# Altium schematic sheet 05 MSM8916_CONTROL.SchDoc
size 868 x 576 mm
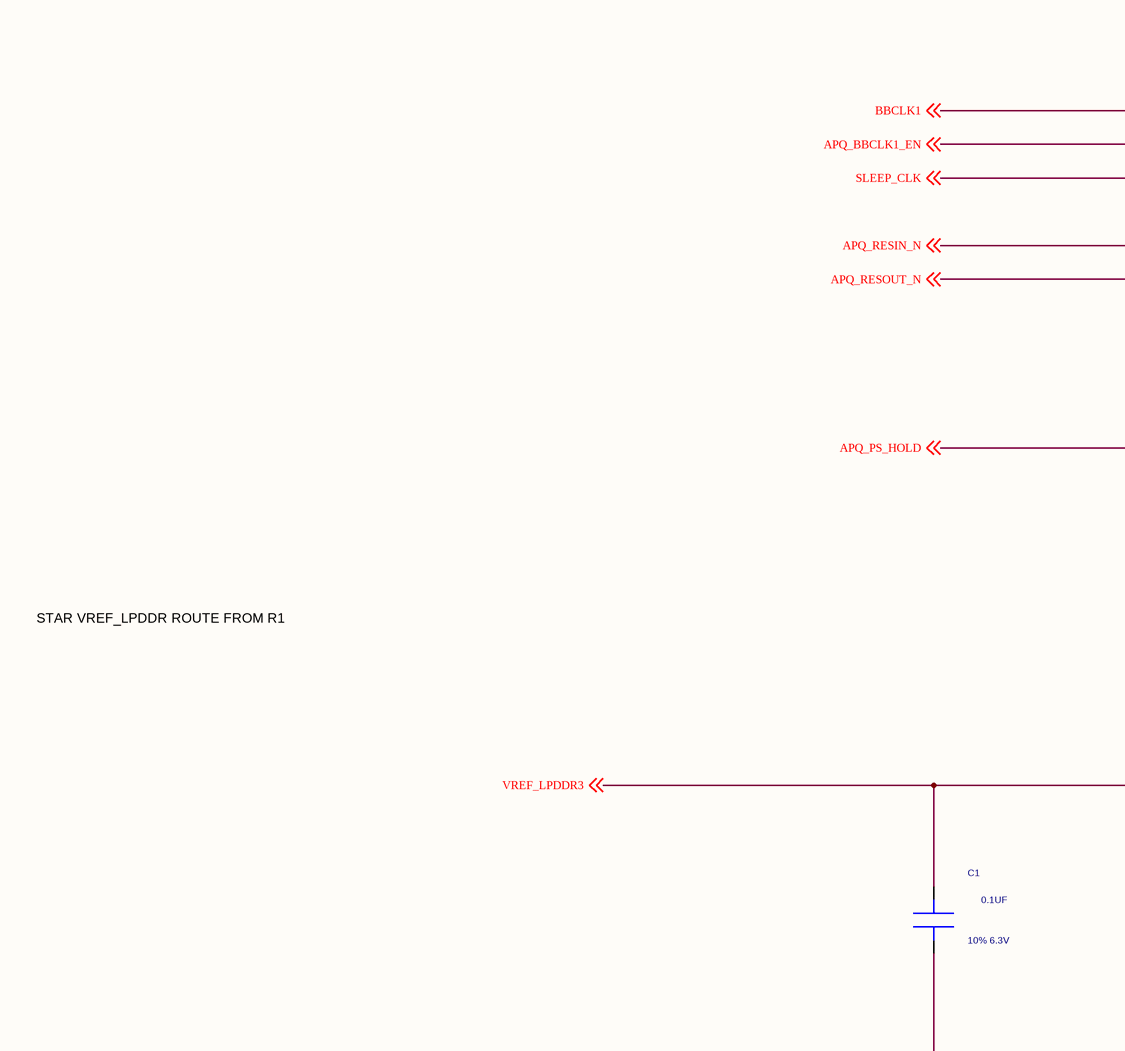
[diagram p0: 05 MSM8916_CONTROL.SchDoc, top left]
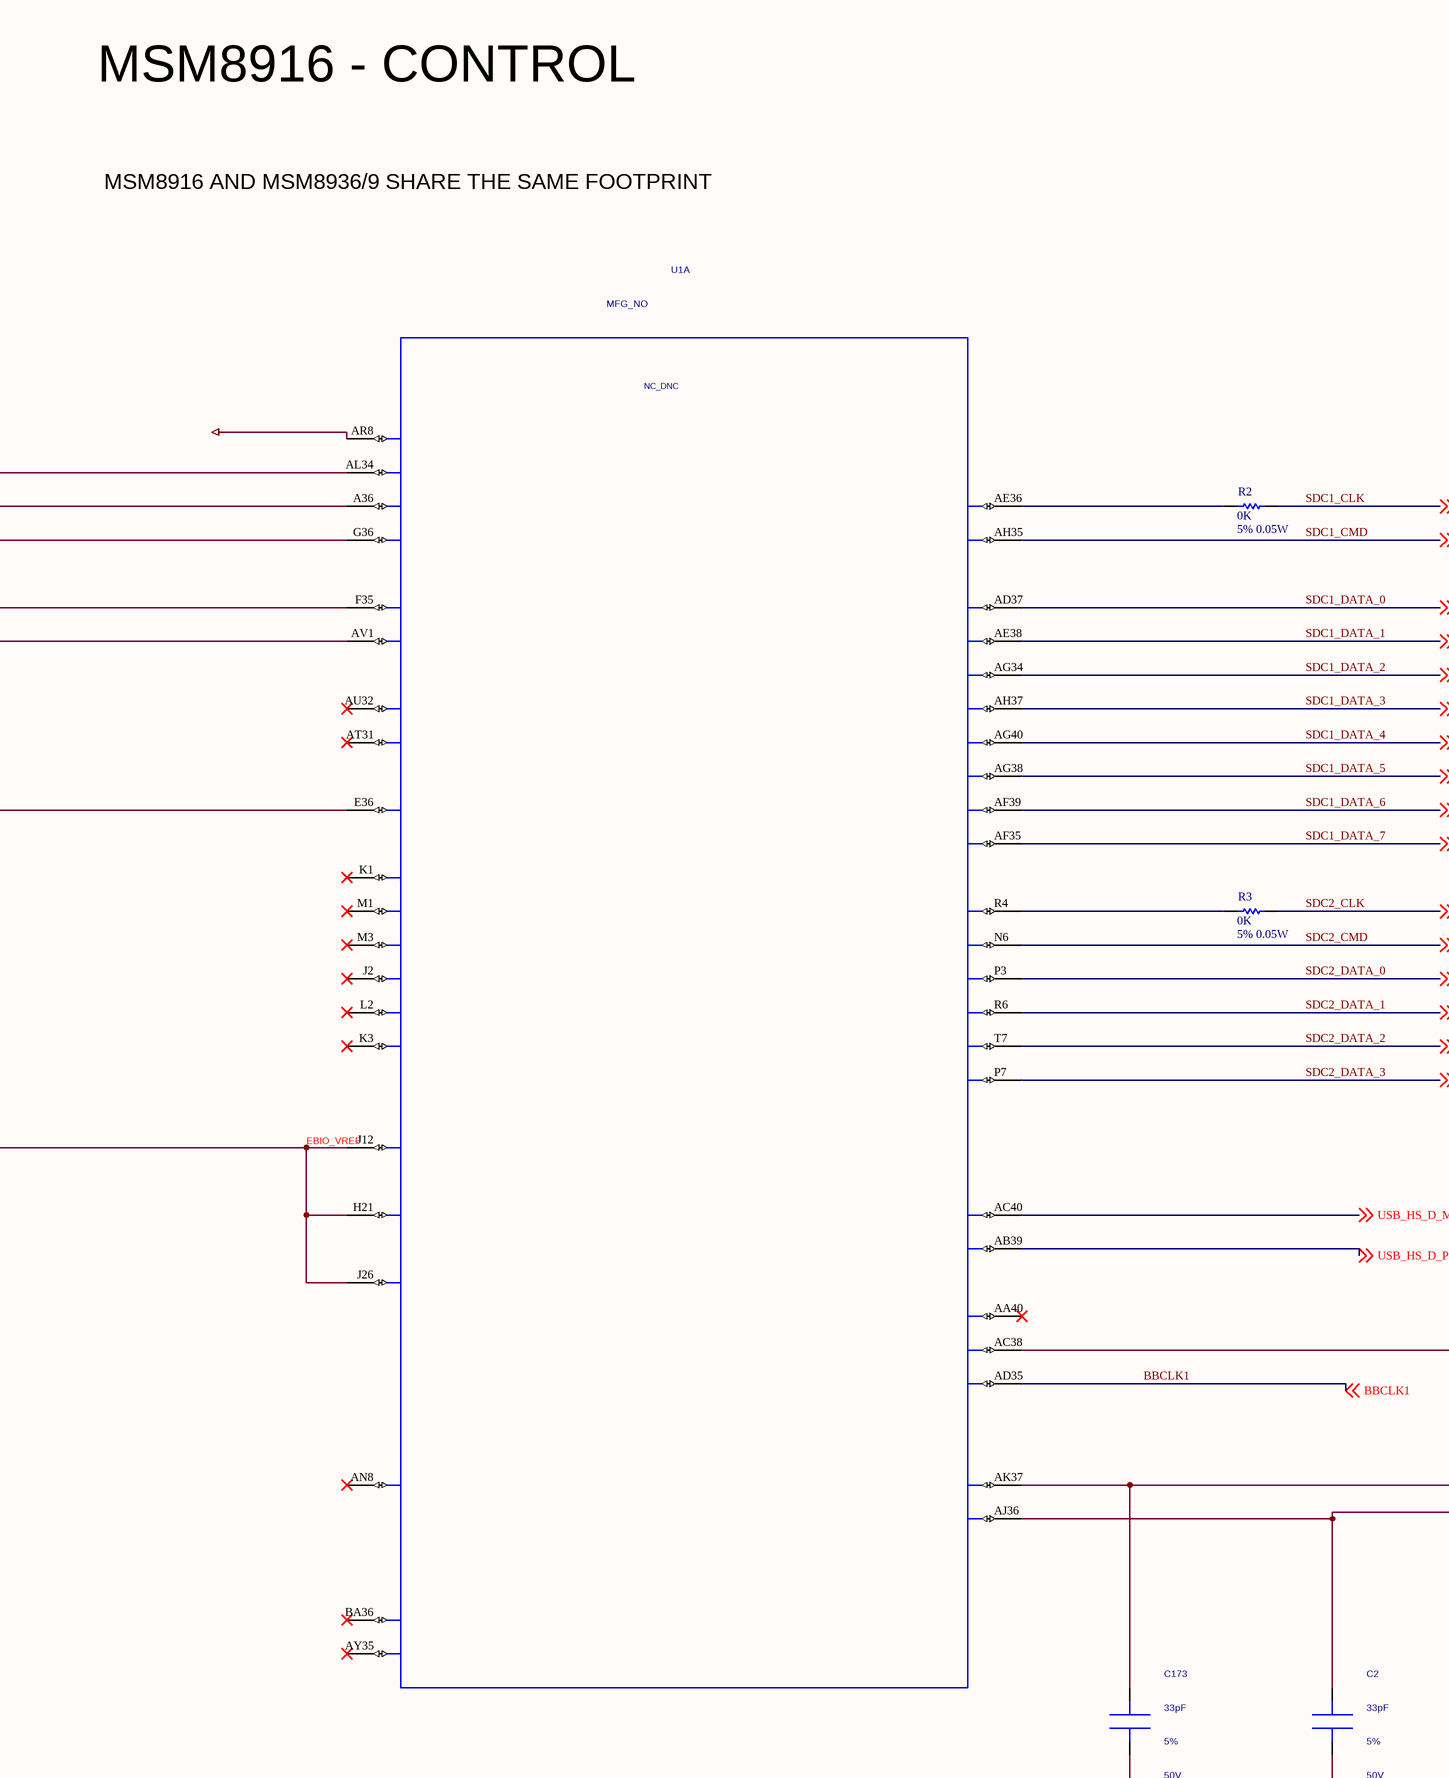
[diagram p1: 05 MSM8916_CONTROL.SchDoc, top middle]
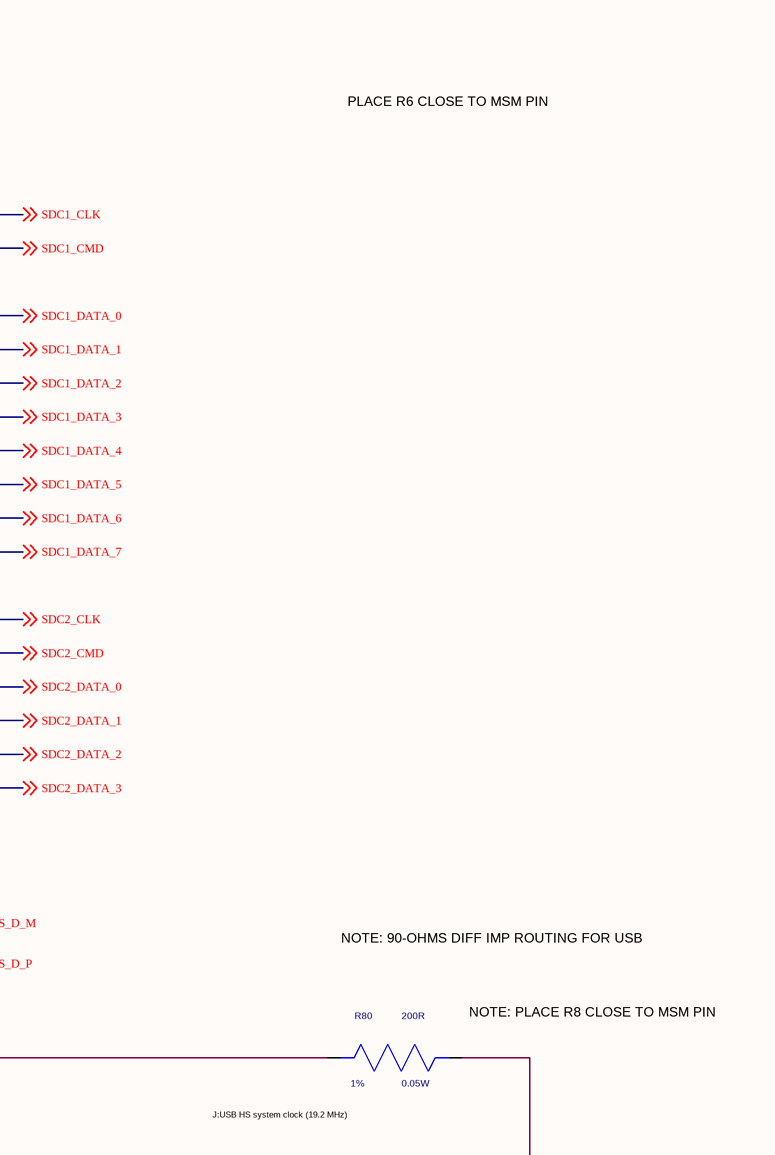
[diagram p2: 05 MSM8916_CONTROL.SchDoc, top right]
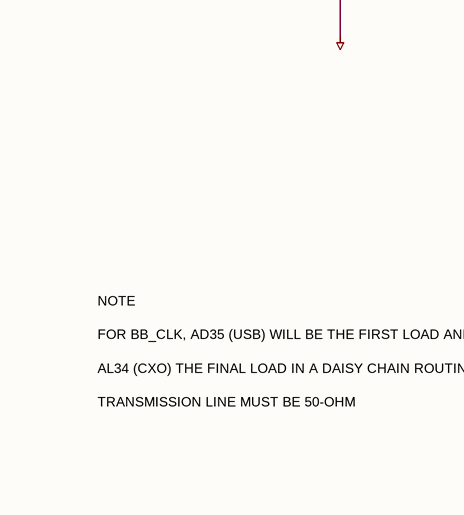
[diagram p3: 05 MSM8916_CONTROL.SchDoc, bottom left]
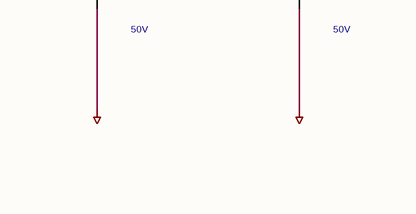
[diagram p4: 05 MSM8916_CONTROL.SchDoc, bottom middle]
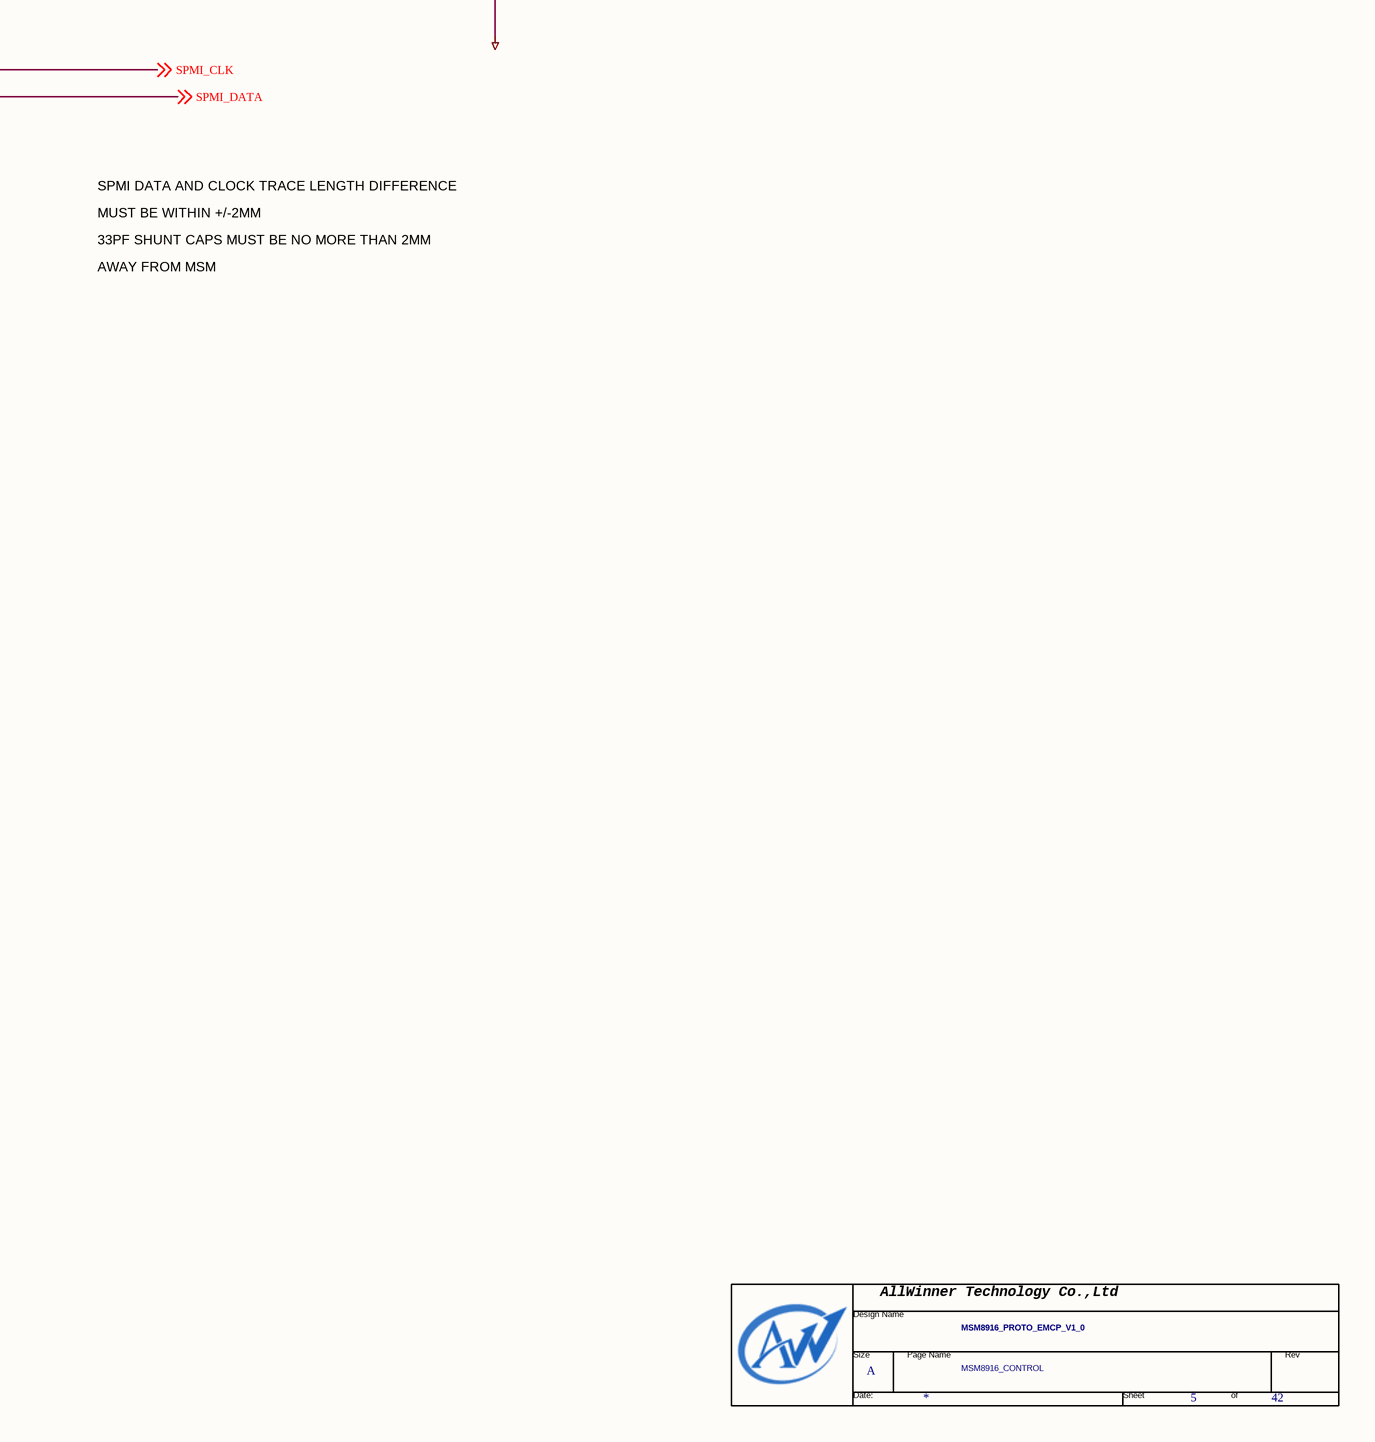
[diagram p5: 05 MSM8916_CONTROL.SchDoc, bottom right]

## Parts
*  Page Count: 42  Page Number: 5  Page Size: A  Title: MSM8916_PROTO_EMCP_V1_0  Doc: MSM8916_CONTROL  (hidden comment: TitleBlock0-AW)  (graphical)
C1  0.1UF  Tolerance: 10% 6.3V  [c0402]
C2  33pF  VOLT: 50V  Tolerance: 5%  [c0402]
C173  33pF  VOLT: 50V  Tolerance: 5%  [c0402]
R2  0K  value 5% 0.05W  [r0402]
R3  0K  value 5% 0.05W  [r0402]
R80  200R  Tolerance: 1%  POWER: 0.05W  [c0402]
U1  SYMNAME: NC_DNC  PART_ID: MFG_NO  [MSM-8916-0-760NSP-TR-00-0]  (hidden comment: ASIC_MSM8936_760PIN)  (part A of 13)

## Nets
DGND: C1.2(NEG) C2.2(NEG) C173.2(NEG) R80.2(NEG) U1.AR8(WCSS_XO)
APQ_BBCLK1_EN: U1.A36(CXO_EN) ; off-sheet APQ_BBCLK1_EN
APQ_PS_HOLD: U1.E36(PS_HOLD) ; off-sheet APQ_PS_HOLD
APQ_RESIN_N: U1.F35(RESIN*) ; off-sheet APQ_RESIN_N
APQ_RESOUT_N: U1.AV1(RESOUT*) ; off-sheet APQ_RESOUT_N
BBCLK1: U1.AD35(USB2_HS_SYSCLOCK) U1.AL34(CXO) ; off-sheet BBCLK1
EBIO_VREF: C1.1(POS) U1.H21(VREF_EBI0_D0_D2) U1.J12(VREF_EBI0_CA) U1.J26(VREF_EBI0_D1_D3) ; off-sheet VREF_LPDDR3  [also labelled VREF_LPDDR3]
SDC1_CLK: R2.2 ; off-sheet SDC1_CLK
SDC1_CMD: U1.AH35(SDC1_CMD) ; off-sheet SDC1_CMD
SDC1_DATA_0: U1.AD37(SDC1_DATA_0) ; off-sheet SDC1_DATA_0
SDC1_DATA_1: U1.AE38(SDC1_DATA_1) ; off-sheet SDC1_DATA_1
SDC1_DATA_2: U1.AG34(SDC1_DATA_2) ; off-sheet SDC1_DATA_2
SDC1_DATA_3: U1.AH37(SDC1_DATA_3) ; off-sheet SDC1_DATA_3
SDC1_DATA_4: U1.AG40(SDC1_DATA_4) ; off-sheet SDC1_DATA_4
SDC1_DATA_5: U1.AG38(SDC1_DATA_5) ; off-sheet SDC1_DATA_5
SDC1_DATA_6: U1.AF39(SDC1_DATA_6) ; off-sheet SDC1_DATA_6
SDC1_DATA_7: U1.AF35(SDC1_DATA_7) ; off-sheet SDC1_DATA_7
SDC2_CLK: R3.2 ; off-sheet SDC2_CLK
SDC2_CMD: U1.N6(SDC2_CMD) ; off-sheet SDC2_CMD
SDC2_DATA_0: U1.P3(SDC2_DATA_0) ; off-sheet SDC2_DATA_0
SDC2_DATA_1: U1.R6(SDC2_DATA_1) ; off-sheet SDC2_DATA_1
SDC2_DATA_2: U1.T7(SDC2_DATA_2) ; off-sheet SDC2_DATA_2
SDC2_DATA_3: U1.P7(SDC2_DATA_3) ; off-sheet SDC2_DATA_3
SLEEP_CLK: U1.G36(SLEEP_CLK) ; off-sheet SLEEP_CLK
SPMI_CLK: C173.1(POS) U1.AK37(PMIC_SPMI_CLK) ; off-sheet SPMI_CLK
SPMI_DATA: C2.1(POS) U1.AJ36(PMIC_SPMI_DATA) ; off-sheet SPMI_DATA
USB_HS_D_M: U1.AC40(USB2_HS_DM) ; off-sheet USB_HS_D_M
USB_HS_D_P: U1.AB39(USB2_HS_DP) ; off-sheet USB_HS_D_P
NetR2_1: R2.1 U1.AE36(SDC1_CLK)
NetR3_1: R3.1 U1.R4(SDC2_CLK)
NetR80_1: R80.1(POS) U1.AC38(USB2_HS_TXRTUNE)

Not connected (* = marked no-connect by the designer): U1 AA40(USB2_HS_ID)* AN8(PLL_TEST_SE)* AT31(MODE_1)* AU32(MODE_0)* AY35(ATEST1)* BA36(ATEST0)* J2(TDO)* K1(SRST*)* K3(TRST*)* L2(TMS)* M1(TCK)* M3(TDI)*

## Notes on the sheet
- MSM8916 - CONTROL
- MSM8916 AND MSM8936/9 SHARE THE SAME FOOTPRINT
- PLACE R6 CLOSE TO MSM PIN
- STAR VREF_LPDDR ROUTE FROM R1
- NOTE: 90-OHMS DIFF IMP ROUTING FOR USB
- (near R80) NOTE: PLACE R8 CLOSE TO MSM PIN
- J:USB HS system clock (19.2 MHz)
- SPMI DATA AND CLOCK TRACE LENGTH DIFFERENCE
- MUST BE WITHIN +/-2MM
- 33PF SHUNT CAPS MUST BE NO MORE THAN 2MM
- AWAY FROM MSM
- FOR BB_CLK, AD35 (USB) WILL BE THE FIRST LOAD AND
- NOTE
- AL34 (CXO) THE FINAL LOAD IN A DAISY CHAIN ROUTING
- TRANSMISSION LINE MUST BE 50-OHM
- (in symbol TitleBlock0-AW) AllWinner Technology Co.,Ltd; Design Name; Size; Page Name; Rev; Date:; Sheet; of

## Library data of the parts
C1 = CAP: PART_NUMBER: MCN_NO; PART_ID: MFG_NO; OriginalSymbolOrigin: (-100,75); VOLT: ?V; CDS_LMAN_SYM_OUTLINE: -75,25,75,-25; SYMNAME: CAP; PACK_TYPE: ?
C2 C173 = CAP: PART_NUMBER: MCN_NO; PART_ID: MFG_NO; OriginalSymbolOrigin: (-100,75); CDS_LMAN_SYM_OUTLINE: -75,25,75,-25; SYMNAME: CAP; PACK_TYPE: ?
R2 R3 = Res1: Resistor; Published: 8-Jun-2000; LatestRevisionDate: 17-Jul-2002; LatestRevisionNote: Re-released for DXP Platform.; PackageReference: AXIAL-0.3; Publisher: Altium Limited; PackageDescription: Axial Device, Thru-Hole; 2 Leads; 0.3 in Pin Spacing
R80 = RESISTOR_Dup3: PART_NUMBER: MCN_NO; PART_ID: MFG_NO; OriginalSymbolOrigin: (-200,50); CDS_LMAN_SYM_OUTLINE: -150,50,150,-50; SYMNAME: resistor; PACK_TYPE: ?
U1 = ASIC_MSM8936_760PIN: PART_NUMBER: MCN_NO; OriginalSymbolOrigin: (-1100,2500); SPLIT_INST: TRUE; CDS_LMAN_SYM_OUTLINE: -1050,2500,1050,-2500; CDS_LMAN_SPLIT_NUMBER: 1 of 13; PACK_TYPE: ?
* = TitleBlock0-AW: RevCode: ?; Page Create Date: March  8, 1995; Page Modify Date: *